# Altium schematic sheet Measure_v2_301115.SchDoc
size A3
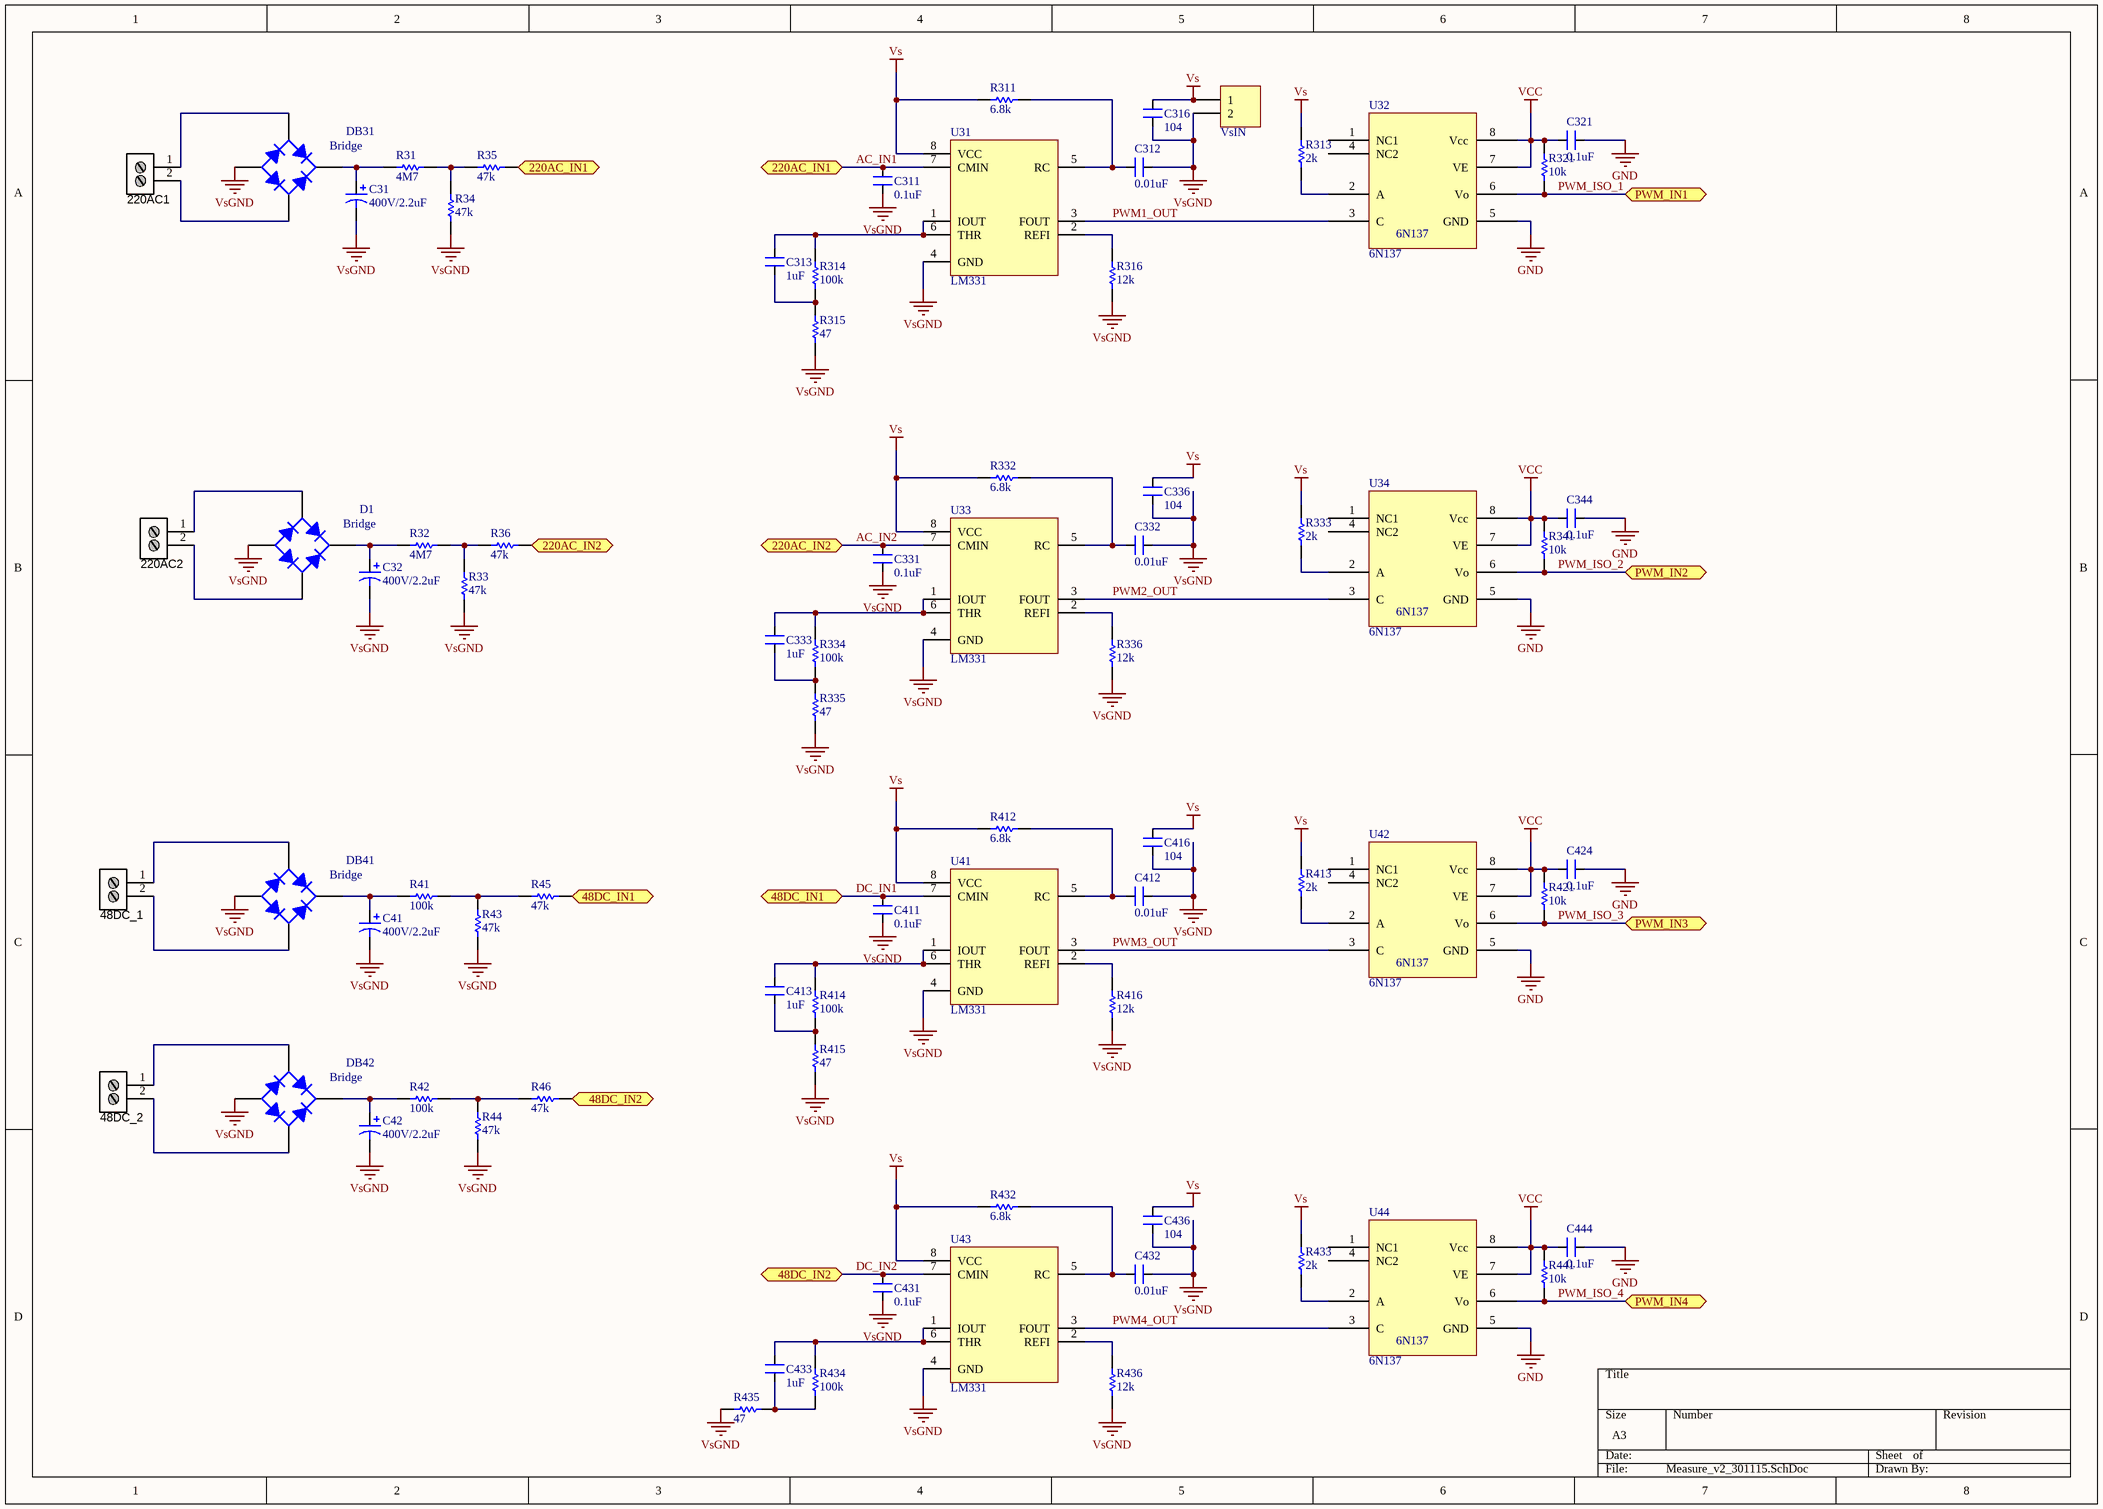
[diagram p0: Measure_v2_301115.SchDoc]

## Parts
48DC_1  Stackable ScrewTerm  [2P_PCB_ScrewTerm_200mil]  (value not drawn)
48DC_2  Stackable ScrewTerm  [2P_PCB_ScrewTerm_200mil]  (value not drawn)
220AC1  Stackable ScrewTerm  [2P_PCB_ScrewTerm_200mil]  (value not drawn)
220AC2  Stackable ScrewTerm  [2P_PCB_ScrewTerm_200mil]  (value not drawn)
C31  value 400V/2.2uF  [CAP 3.8mm]  (hidden comment: Cap)
C32  value 400V/2.2uF  [CAP 3.8mm]  (hidden comment: Cap)
C41  value 400V/2.2uF  [CAP 3.8mm]  (hidden comment: Cap)
C42  value 400V/2.2uF  [CAP 3.8mm]  (hidden comment: Cap)
C311  value 0.1uF  [CAPC2012N_F]  (hidden comment: CAP NP)
C312  value 0.01uF  [CAPC2012N_F]  (hidden comment: CAP NP)
C313  value 1uF  [CAPC2012N_F]  (hidden comment: CAP NP)
C316  value 104  [CAPC2012N_F]  (hidden comment: CAP NP)
C321  value 0.1uF  [CAPC2012N_F]  (hidden comment: CAP NP)
C331  value 0.1uF  [CAPC2012N_F]  (hidden comment: CAP NP)
C332  value 0.01uF  [CAPC2012N_F]  (hidden comment: CAP NP)
C333  value 1uF  [CAPC2012N_F]  (hidden comment: CAP NP)
C336  value 104  [CAPC2012N_F]  (hidden comment: CAP NP)
C344  value 0.1uF  [CAPC2012N_F]  (hidden comment: CAP NP)
C411  value 0.1uF  [CAPC2012N_F]  (hidden comment: CAP NP)
C412  value 0.01uF  [CAPC2012N_F]  (hidden comment: CAP NP)
C413  value 1uF  [CAPC2012N_F]  (hidden comment: CAP NP)
C416  value 104  [CAPC2012N_F]  (hidden comment: CAP NP)
C424  value 0.1uF  [CAPC2012N_F]  (hidden comment: CAP NP)
C431  value 0.1uF  [CAPC2012N_F]  (hidden comment: CAP NP)
C432  value 0.01uF  [CAPC2012N_F]  (hidden comment: CAP NP)
C433  value 1uF  [CAPC2012N_F]  (hidden comment: CAP NP)
C436  value 104  [CAPC2012N_F]  (hidden comment: CAP NP)
C444  value 0.1uF  [CAPC2012N_F]  (hidden comment: CAP NP)
D1  Bridge  [MB6S]
DB31  Bridge  [MB6S]
DB41  Bridge  [MB6S]
DB42  Bridge  [MB6S]
R31  value 4M7  [RESTH_0.0R_AXIAL-0.6]  (hidden comment: Res)
R32  value 4M7  [RESTH_0.0R_AXIAL-0.6]  (hidden comment: Res)
R33  value 47k  [RESTH_0.0R_AXIAL-0.6]  (hidden comment: Res)
R34  value 47k  [RESTH_0.0R_AXIAL-0.6]  (hidden comment: Res)
R35  value 47k  [RESC2012N_F]  (hidden comment: Res)
R36  value 47k  [RESC2012N_F]  (hidden comment: Res)
R41  value 100k  [RESTH_0.0R_AXIAL-0.6]  (hidden comment: Res)
R42  value 100k  [RESTH_0.0R_AXIAL-0.6]  (hidden comment: Res)
R43  value 47k  [RESTH_0.0R_AXIAL-0.6]  (hidden comment: Res)
R44  value 47k  [RESTH_0.0R_AXIAL-0.6]  (hidden comment: Res)
R45  value 47k  [RESC2012N_F]  (hidden comment: Res)
R46  value 47k  [RESC2012N_F]  (hidden comment: Res)
R311  value 6.8k  [RESC2012N_F]  (hidden comment: Res)
R313  value 2k  [RESC2012N_F]  (hidden comment: Res)
R314  value 100k  [RESC2012N_F]  (hidden comment: Res)
R315  value 47  [RESC2012N_F]  (hidden comment: Res)
R316  value 12k  [RESC2012N_F]  (hidden comment: Res)
R321  value 10k  [RESC2012N_F]  (hidden comment: Res)
R332  value 6.8k  [RESC2012N_F]  (hidden comment: Res)
R333  value 2k  [RESC2012N_F]  (hidden comment: Res)
R334  value 100k  [RESC2012N_F]  (hidden comment: Res)
R335  value 47  [RESC2012N_F]  (hidden comment: Res)
R336  value 12k  [RESC2012N_F]  (hidden comment: Res)
R341  value 10k  [RESC2012N_F]  (hidden comment: Res)
R412  value 6.8k  [RESC2012N_F]  (hidden comment: Res)
R413  value 2k  [RESC2012N_F]  (hidden comment: Res)
R414  value 100k  [RESC2012N_F]  (hidden comment: Res)
R415  value 47  [RESC2012N_F]  (hidden comment: Res)
R416  value 12k  [RESC2012N_F]  (hidden comment: Res)
R421  value 10k  [RESC2012N_F]  (hidden comment: Res)
R432  value 6.8k  [RESC2012N_F]  (hidden comment: Res)
R433  value 2k  [RESC2012N_F]  (hidden comment: Res)
R434  value 100k  [RESC2012N_F]  (hidden comment: Res)
R435  value 47  [RESC2012N_F]  (hidden comment: Res)
R436  value 12k  [RESC2012N_F]  (hidden comment: Res)
R441  value 10k  [RESC2012N_F]  (hidden comment: Res)
U31  LM331  [DIP8-300]
U32  6N137  [SMD-8]
U33  LM331  [DIP8-300]
U34  6N137  [SMD-8]
U41  LM331  [DIP8-300]
U42  6N137  [SMD-8]
U43  LM331  [DIP8-300]
U44  6N137  [SMD-8]
VsIN  Header 2  [HDR1X2]  (value not drawn)

## Ports
48DC_IN1, 48DC_IN2, 220AC_IN1, 220AC_IN2, PWM_IN1, PWM_IN2, PWM_IN3, PWM_IN4

## Nets
GND: C321.1 C344.1 C424.1 C444.1 U32.5(GND) U34.5(GND) U42.5(GND) U44.5(GND)
VCC: C321.2 C344.2 C424.2 C444.2 R321.2 R341.2 R421.2 R441.2 U32.7(VE) U32.8(Vcc) U34.7(VE) U34.8(Vcc) U42.7(VE) U42.8(Vcc) U44.7(VE) U44.8(Vcc)
Vs: C316.2 C336.2 C416.2 C436.2 R311.1 R313.2 R332.1 R333.2 R412.1 R413.2 R432.1 R433.2 U31.8(VCC) U33.8(VCC) U41.8(VCC) U43.8(VCC) VsIN.1
VsGND: C31.2 C32.2 C41.2 C42.2 C311.1 C312.1 C316.1 C331.1 C332.1 C336.1 C411.1 C412.1 C416.1 C431.1 C432.1 C436.1 D1.3(A) DB31.3(A) DB41.3(A) DB42.3(A) R33.1 R34.1 R43.1 R44.1 R315.1 R316.1 R335.1 R336.1 R415.1 R416.1 R435.2 R436.1 U31.4(GND) U33.4(GND) U41.4(GND) U43.4(GND) VsIN.2
AC_IN1: C311.2 R35.2 U31.7(CMIN) ; port 220AC_IN1
AC_IN2: C331.2 R36.2 U33.7(CMIN) ; port 220AC_IN2
DC_IN1: C411.2 R45.2 U41.7(CMIN) ; port 48DC_IN1
DC_IN2: C431.2 R46.2 U43.7(CMIN) ; port 48DC_IN2
PWM1_OUT: U31.3(FOUT) U32.3(C)
PWM2_OUT: U33.3(FOUT) U34.3(C)
PWM3_OUT: U41.3(FOUT) U42.3(C)
PWM4_OUT: U43.3(FOUT) U44.3(C)
PWM_ISO_1: R321.1 U32.6(Vo) ; port PWM_IN1
PWM_ISO_2: R341.1 U34.6(Vo) ; port PWM_IN2
PWM_ISO_3: R421.1 U42.6(Vo) ; port PWM_IN3
PWM_ISO_4: R441.1 U44.6(Vo) ; port PWM_IN4
Net48DC_1_1: 48DC_1.1 DB41.4(C)
Net48DC_1_2: 48DC_1.2 DB41.2(C)
Net48DC_2_1: 48DC_2.1 DB42.4(C)
Net48DC_2_2: 48DC_2.2 DB42.2(C)
Net220AC1_1: 220AC1.1 DB31.4(C)
Net220AC1_2: 220AC1.2 DB31.2(C)
Net220AC2_1: 220AC2.1 D1.4(C)
Net220AC2_2: 220AC2.2 D1.2(C)
NetC31_1: C31.1 DB31.1(K) R31.1
NetC32_1: C32.1 D1.1(K) R32.1
NetC41_1: C41.1 DB41.1(K) R41.1
NetC42_1: C42.1 DB42.1(K) R42.1
NetC312_2: C312.2 R311.2 U31.5(RC)
NetC313_1: C313.1 R314.2 U31.1(IOUT) U31.6(THR)
NetC313_2: C313.2 R314.1 R315.2
NetC332_2: C332.2 R332.2 U33.5(RC)
NetC333_1: C333.1 R334.2 U33.1(IOUT) U33.6(THR)
NetC333_2: C333.2 R334.1 R335.2
NetC412_2: C412.2 R412.2 U41.5(RC)
NetC413_1: C413.1 R414.2 U41.1(IOUT) U41.6(THR)
NetC413_2: C413.2 R414.1 R415.2
NetC432_2: C432.2 R432.2 U43.5(RC)
NetC433_1: C433.1 R434.2 U43.1(IOUT) U43.6(THR)
NetC433_2: C433.2 R434.1 R435.1
NetR31_2: R31.2 R34.2 R35.1
NetR32_2: R32.2 R33.2 R36.1
NetR41_2: R41.2 R43.2 R45.1
NetR42_2: R42.2 R44.2 R46.1
NetR313_1: R313.1 U32.2(A)
NetR316_2: R316.2 U31.2(REFI)
NetR333_1: R333.1 U34.2(A)
NetR336_2: R336.2 U33.2(REFI)
NetR413_1: R413.1 U42.2(A)
NetR416_2: R416.2 U41.2(REFI)
NetR433_1: R433.1 U44.2(A)
NetR436_2: R436.2 U43.2(REFI)

Not connected (* = marked no-connect by the designer): U32 1(NC1) 4(NC2); U34 1(NC1) 4(NC2); U42 1(NC1) 4(NC2); U44 1(NC1) 4(NC2)

## Library data of the parts
48DC_1 48DC_2 220AC1 220AC2 = 2P_ScrewTerm_90S_3.81MM: Terminal Block Screw Type THT 2-Position 3.81mm pitch; Manufacturer 1: Tyco Electronics; Manufacturer Part Number 1: 1776113-2; Value: 2 position; Pitch: 0.150" (3.81mm); Positions Per Level: 2; Package / Case: Side Entry; 3.81mm pitch; Category: Connectors Interconnects; Color: Black; Supplier 1: Digi-Key; Supplier Part Number 1: A97976-ND
D1 DB31 DB41 DB42 = Bridge1: Full Wave Diode Bridge; pin to pad: 2>3 3>4 4>2; Published: 8-Jun-2000; LatestRevisionDate: 29-May-2009; LatestRevisionNote: Sch pins A & K swapped.; DatasheetVersion: E2732B; PackageReference: D-38; Publisher: Altium Limited; PackageDescription: Bridge Rectifier; 4 Terminals; Body 9.4 x 9.4 mm (typ); Pitch 5.08 mm
VsIN = Header 2: Header, 2-Pin; LatestRevisionDate: 17-Jul-2002; LatestRevisionNote: Re-released for DXP Platform.; Publisher: Altium Limited